# Altium schematic sheet Power.SchDoc
size A; SheetNumber: 1; SheetTotal: 4
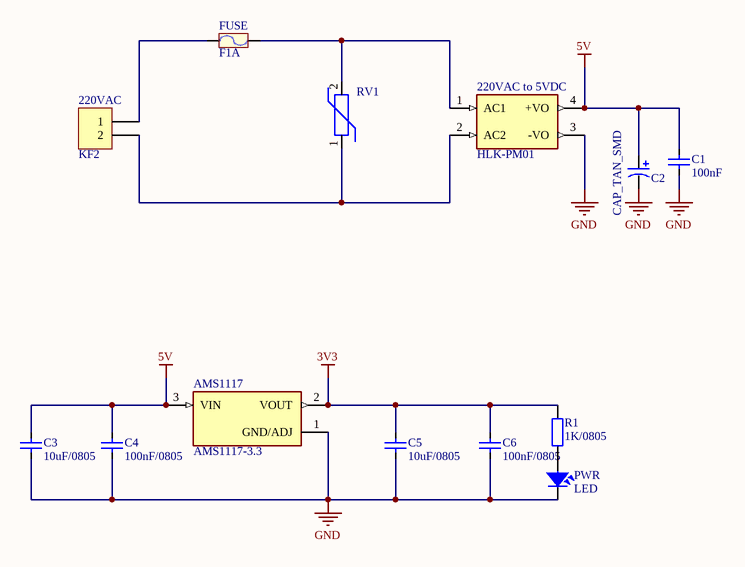
[diagram p0: Power.SchDoc]

## Parts
220VAC  KF2  [KF2-7.62]
220VAC_to_5VDC  HLK-PM01  [CONV_HLK-PM01]
AMS1117  AMS1117-3.3  [SOT229P700X180-4N]
C1  100nF  [CAP_0402]
C2  CAP_TAN_SMD  [CAP_7343]
C3  10uF/0805  [CAP_0805]
C4  100nF/0805  [CAP_0805]
C5  10uF/0805  [CAP_0805]
C6  100nF/0805  [CAP_0805]
FUSE  F1A  [Fuse4]
PWR  LED  [LED-0805-Green]
R1  1K/0805  [RES-SMD-0805]
RV1  MOV-14D471K  [MOV14D471K]  (value not drawn)

## Nets
3V3: AMS1117.2(VOUT) C5.2 C6.2 R1.1
5V: 220VAC_to_5VDC.4(+VO) AMS1117.3(VIN) C1.2 C2.1 C3.2 C4.2
GND: 220VAC_to_5VDC.3(-VO) AMS1117.1(GND/ADJ) C1.1 C2.2 C3.1 C4.1 C5.1 C6.1 PWR.2
Net220VAC_1: 220VAC.1 FUSE.1
Net220VAC_2: 220VAC.2 220VAC_to_5VDC.2(AC2) RV1.1
Net220VAC_to_5VDC_1: 220VAC_to_5VDC.1(AC1) FUSE.2 RV1.2
NetPWR_1: PWR.1 R1.2

## Library data of the parts
220VAC = KF2: Manufacturer: Würth Elektronik eiSos GmbH; partNo: 691103110002; ComponentLink1 Description: Manufacturer; ComponentLink2 Description: Datasheet; NoPins: 2; Created Date: 29 October 2013; ComponentLink1URL: http://www.we-online.com; ComponentLink2URL: http://katalog.we-online.de/em/datasheet/6911031100xx.pdf; Created by: Karrer Zheng
220VAC_to_5VDC = HLK-PM01: The HLK-PM01 is a small size low cost AC to DC converter which can take in 110V/220V AC at 50/60 Hz and give 5V 3W output. The module is can be used in designs which run on 5V and needs to be powered form the AC mains.; MF: Hi-link; Package: None; Price: None; Value: *; SnapEDA_Link: https://www.snapeda.com/parts/hlk-pm01/Hi-link/view-part/?ref=snap; MP: hlk-pm01; Availability: Not in stock; Check_prices: https://www.snapeda.com/parts/hlk-pm01/Hi-link/view-part/?ref=eda
AMS1117 = AMS1117-3.3: Sot223/Pkg 1-Amp 3.3-Volt Low Drop Out Voltage Regulatator; MF: Advanced Monolithic Systems; Package: SOT-223 Seeed Technology; Value: *; Check_prices: https://www.snapeda.com/parts/AMS1117-3.3/Advanced+Monolithic+Systems/view-part/?ref=eda; Price: None; Availability: Not in stock; MP: AMS1117-3.3; SnapEDA_Link: https://www.snapeda.com/parts/AMS1117-3.3/Advanced+Monolithic+Systems/view-part/?ref=snap
C1 C3-C6 = CapSMD: Capacitor; Value: 33p; Published: 8-Jun-2000; LatestRevisionDate: 17-Jul-2002; LatestRevisionNote: Re-released for DXP Platform.; PackageReference: RAD-0.3; Publisher: Altium Limited
C2 = CAP_TAN_SMD: Polazied Tantalum Capacitor
FUSE = Fuse: Designed by: VanDungEvn; Value: Fuse
PWR = LED: LED Single colour Green and Red; Value: LED 3 ly Single Colour
R1 = Resistor - SMD: Resistor SMD; Manufacturer: Generic Components; Class: Passive; Published: 08/06/2000; Publisher: Altium Hobart Technology Centre
RV1 = MOV-14D471K: 470 V 4.5 kA Varistor 1 Circuit Through Hole Disc 14mm; MF: Bourns; SnapEDA_Link: https://www.snapeda.com/parts/MOV-14D471K/Bourns/view-part/?ref=snap; Check_prices: https://www.snapeda.com/parts/MOV-14D471K/Bourns/view-part/?ref=eda; Value: *; Purchase-URL: https://pricing.snapeda.com/search/part/MOV-14D471K/?ref=eda; Availability: In Stock; MP: MOV-14D471K; Price: None; Package: Disc-14 Bourns